# Altium schematic sheet SD card.SchDoc
size A; SheetNumber: 2; SheetTotal: 31
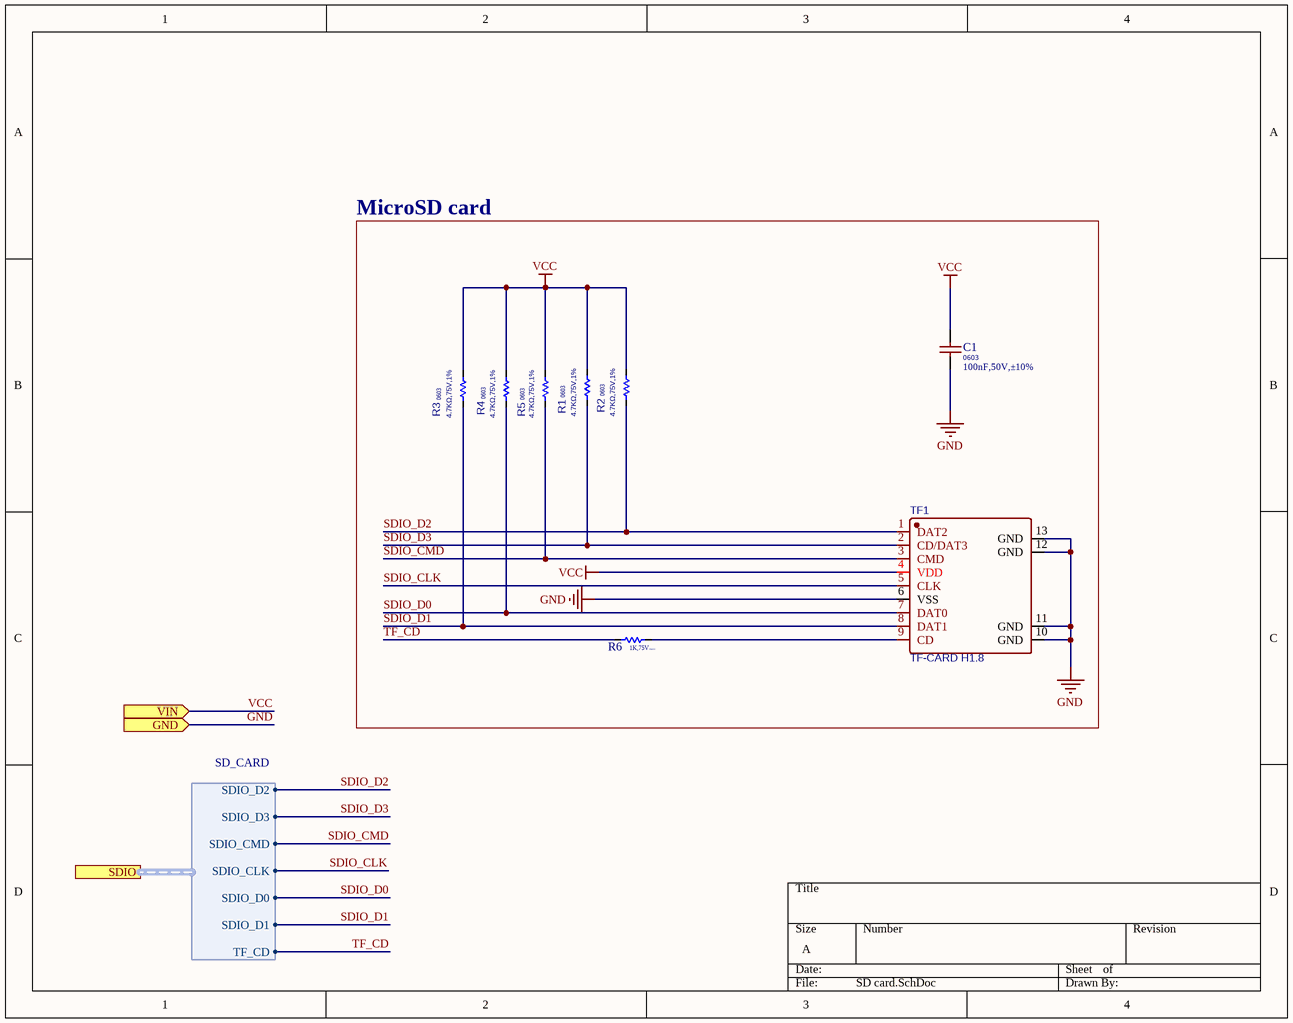
[diagram p0: SD card.SchDoc]

## Parts
C1  value 100nF,50V,±10%  Package: 0603  [C0603]  (hidden comment: CL10B104KB8NNNC)
R1  value 4.7KΩ,75V,1%  Package: 0603  [R0603]  (hidden comment: 4.7KΩ)
R2  value 4.7KΩ,75V,1%  Package: 0603  [R0603]  (hidden comment: 4.7KΩ)
R3  value 4.7KΩ,75V,1%  Package: 0603  [R0603]  (hidden comment: 4.7KΩ)
R4  value 4.7KΩ,75V,1%  Package: 0603  [R0603]  (hidden comment: 4.7KΩ)
R5  value 4.7KΩ,75V,1%  Package: 0603  [R0603]  (hidden comment: 4.7KΩ)
R6  value 1K,75V  Package: 0603  [R0603]  (hidden comment: 1K)
TF1  TF-CARD H1.8  [sd card connector]

## Blocks framed on the sheet
MicroSD card: C1 R1-R6 TF1

## Ports
GND (in), SDIO (harness SD_CARD), VIN (in)

## Harnesses
SD_CARD: SDIO_D2, SDIO_D3, SDIO_CMD, SDIO_CLK, SDIO_D0, SDIO_D1, TF_CD

## Nets
GND: C1.1 TF1.6(VSS) TF1.10(GND) TF1.11(GND) TF1.12(GND) TF1.13(GND) ; port GND
VCC: C1.2 R1.2 R2.2 R3.2 R4.2 R5.2 TF1.4(VDD) ; port VIN
SDIO_CLK: TF1.5(CLK) ; port SDIO.SDIO_CLK
SDIO_CMD: R5.1 TF1.3(CMD) ; port SDIO.SDIO_CMD
SDIO_D0: R4.1 TF1.7(DAT0) ; port SDIO.SDIO_D0
SDIO_D1: R3.1 TF1.8(DAT1) ; port SDIO.SDIO_D1
SDIO_D2: R2.1 TF1.1(DAT2) ; port SDIO.SDIO_D2
SDIO_D3: R1.1 TF1.2(CD/DAT3) ; port SDIO.SDIO_D3
TF_CD: R6.1 ; port SDIO.TF_CD
NetR6_2: R6.2 TF1.9(CD)

## Library data of the parts
C1 = CL10B104KB8NNNC: 50V 100nF X7R ±10% 0603 Multilayer Ceramic Capacitors MLCC - SMD/SMT ROHS; Manufacturer: SAMSUNG; Max Operating Temp: 125; Min Operating Temp: -55; MPN: CL10B104KB8NNNC; Datasheet: https://datasheet.lcsc.com/lcsc/2304140030_Samsung-Electro-Mechanics-CL10B104KB8NNNC_C1591.pdf; LCSC: C1591
R1-R5 = RC0603FR-074K7L: 100mW Thick Film Resistors 75V ±100ppm/℃ ±1% 4.7kΩ 0603 Chip Resistor - Surface Mount ROHS; Manufacturer: YAGEO; MPN: RC0603FR-071KL; Max Operating Temp: +155; Type: *; Datasheet: https://datasheet.lcsc.com/lcsc/2304140030_YAGEO-RC0603FR-074K7L_C99782.pdf; Min Operating Temp: -55; LCSC: C99782
R6 = 0603WAF1001T5E: 100mW Thick Film Resistors 75V ±100ppm/℃ ±1% 1kΩ 0603 Chip Resistor - Surface Mount ROHS; Manufacturer: UNI-ROYAL(Uniroyal Elec); Datasheet: https://datasheet.lcsc.com/szlcsc/Uniroyal-Elec-0603WAF1001T5E_C21190.pdf; MPN: 0603WAF1001T5E; LCSC: C21190
TF1 = TF-CARD H1.8: -40℃~+70℃ 1.8mm Gold Deck MicroSD card (TF card) Copper Alloy Self bomb SMD SD Card Connectors ROHS; Manufacturer: SHOU HAN; LCSC: C7529389; MPN: TF-CARD H1.8; Min Operating Temp: -40; Max Operating Temp: +70; Value: SMD SD Card Connector; Datasheet: https://datasheet.lcsc.com/lcsc/2308181409_SHOU-HAN-TF-CARD-H1-8_C7529389.pdf; Package Reference: MicroSD card (TF card)